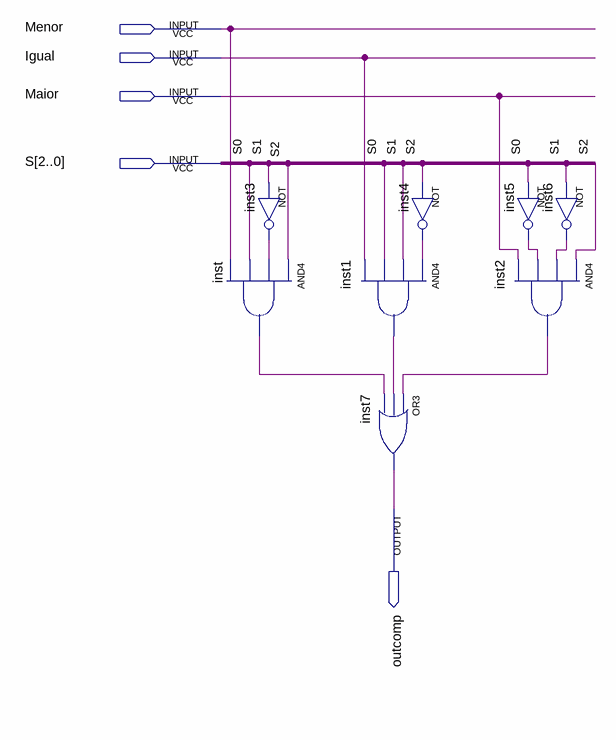
[diagram p0: schematic sheet]
// Quartus schematic MuxSinal.bdf as structural Verilog: 8 symbols, 5 pins
module MuxSinal (
  input  Menor,
  input  Igual,
  input  Maior,
  input  [2:0] S,
  output outcomp
);

  wire inst1_out, inst2_out, inst3_out, inst4_out, inst5_out, inst6_out, inst_out;

  and inst (inst_out, S[2], inst3_out, S[0], Menor);
  not inst3 (inst3_out, S[1]);
  and inst1 (inst1_out, inst4_out, S[1], S[0], Igual);
  or inst7 (outcomp, inst2_out, inst1_out, inst_out);
  not inst4 (inst4_out, S[2]);
  not inst5 (inst5_out, S[0]);
  and inst2 (inst2_out, S[2], inst6_out, inst5_out, Maior);
  not inst6 (inst6_out, S[1]);
endmodule
